# Altium schematic sheet 4. PT100.SchDoc: 4. PT100
size A4; CompanyName: Keri Studio; DrawnBy: Ashish Talaviya; Organization: KERI STUDIO; Address1: ICG COMPOUND; Address2: NR. BHAVANI CIRCLE; Address3: A.K. ROAD; Address4: SURAT-395008; DocumentNumber: 4; Revision: 1.0; SheetNumber: 4; SheetTotal: 4
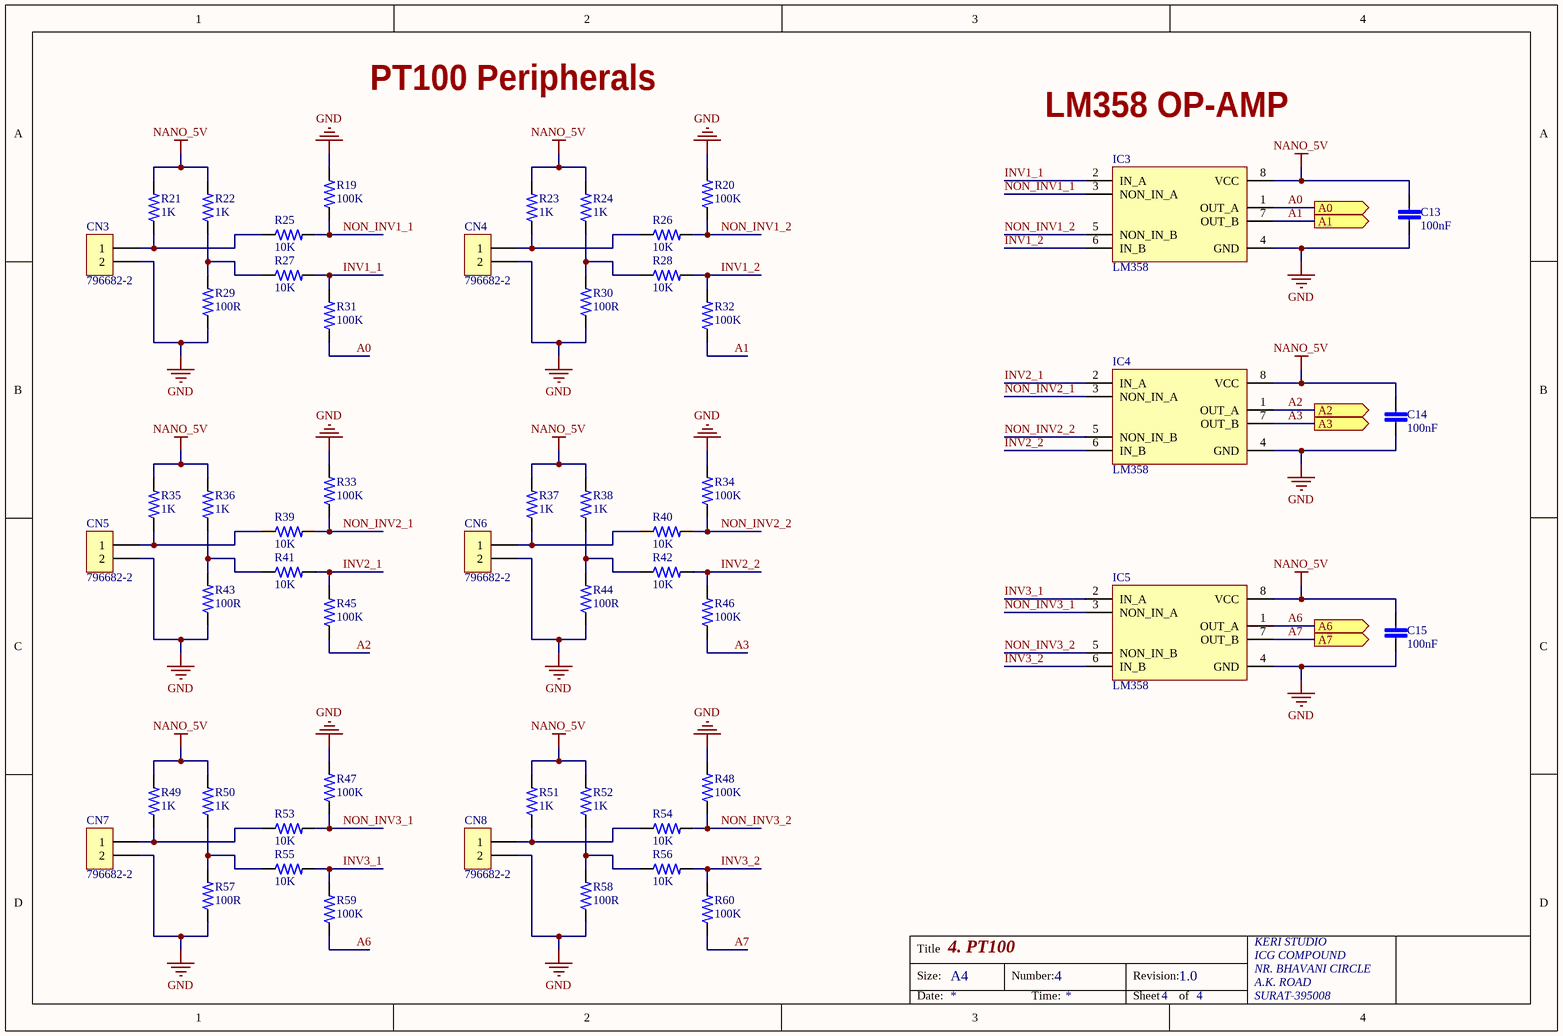
[diagram p0: 4. PT100.SchDoc]

## Parts
C13  100nF  [C0805]
C14  100nF  [C0805]
C15  100nF  [C0805]
CN3  796682-2  [Terminal_5.08mm_1X02]
CN4  796682-2  [Terminal_5.08mm_1X02]
CN5  796682-2  [Terminal_5.08mm_1X02]
CN6  796682-2  [Terminal_5.08mm_1X02]
CN7  796682-2  [Terminal_5.08mm_1X02]
CN8  796682-2  [Terminal_5.08mm_1X02]
IC3  LM358  [DIP-08]
IC4  LM358  [DIP-08]
IC5  LM358  [DIP-08]
R19  100K  [R0805]
R20  100K  [R0805]
R21  1K  [R0805]
R22  1K  [R0805]
R23  1K  [R0805]
R24  1K  [R0805]
R25  10K  [R0805]
R26  10K  [R0805]
R27  10K  [R0805]
R28  10K  [R0805]
R29  100R  [R0805]
R30  100R  [R0805]
R31  100K  [R0805]
R32  100K  [R0805]
R33  100K  [R0805]
R34  100K  [R0805]
R35  1K  [R0805]
R36  1K  [R0805]
R37  1K  [R0805]
R38  1K  [R0805]
R39  10K  [R0805]
R40  10K  [R0805]
R41  10K  [R0805]
R42  10K  [R0805]
R43  100R  [R0805]
R44  100R  [R0805]
R45  100K  [R0805]
R46  100K  [R0805]
R47  100K  [R0805]
R48  100K  [R0805]
R49  1K  [R0805]
R50  1K  [R0805]
R51  1K  [R0805]
R52  1K  [R0805]
R53  10K  [R0805]
R54  10K  [R0805]
R55  10K  [R0805]
R56  10K  [R0805]
R57  100R  [R0805]
R58  100R  [R0805]
R59  100K  [R0805]
R60  100K  [R0805]

## Ports
A0 (out), A1 (out), A2 (out), A3 (out), A6 (out), A7 (out)

## Nets
GND: C13.2 C14.2 C15.2 CN3.2 CN4.2 CN5.2 CN6.2 CN7.2 CN8.2 IC3.4(GND) IC4.4(GND) IC5.4(GND) R19.2 R20.2 R29.1 R30.1 R33.2 R34.2 R43.1 R44.1 R47.2 R48.2 R57.1 R58.1
NANO_5V: C13.1 C14.1 C15.1 IC3.8(VCC) IC4.8(VCC) IC5.8(VCC) R21.2 R22.2 R23.2 R24.2 R35.2 R36.2 R37.2 R38.2 R49.2 R50.2 R51.2 R52.2
A0: IC3.1(OUT_A) R31.1 ; port A0
A1: IC3.7(OUT_B) R32.1 ; port A1
A2: IC4.1(OUT_A) R45.1 ; port A2
A3: IC4.7(OUT_B) R46.1 ; port A3
A6: IC5.1(OUT_A) R59.1 ; port A6
A7: IC5.7(OUT_B) R60.1 ; port A7
INV1_1: IC3.2(IN_A) R27.2 R31.2
INV1_2: IC3.6(IN_B) R28.2 R32.2
INV2_1: IC4.2(IN_A) R41.2 R45.2
INV2_2: IC4.6(IN_B) R42.2 R46.2
INV3_1: IC5.2(IN_A) R55.2 R59.2
INV3_2: IC5.6(IN_B) R56.2 R60.2
NON_INV1_1: IC3.3(NON_IN_A) R19.1 R25.2
NON_INV1_2: IC3.5(NON_IN_B) R20.1 R26.2
NON_INV2_1: IC4.3(NON_IN_A) R33.1 R39.2
NON_INV2_2: IC4.5(NON_IN_B) R34.1 R40.2
NON_INV3_1: IC5.3(NON_IN_A) R47.1 R53.2
NON_INV3_2: IC5.5(NON_IN_B) R48.1 R54.2
NetCN3_1: CN3.1 R21.1 R25.1
NetCN4_1: CN4.1 R23.1 R26.1
NetCN5_1: CN5.1 R35.1 R39.1
NetCN6_1: CN6.1 R37.1 R40.1
NetCN7_1: CN7.1 R49.1 R53.1
NetCN8_1: CN8.1 R51.1 R54.1
NetR22_1: R22.1 R27.1 R29.2
NetR24_1: R24.1 R28.1 R30.2
NetR36_1: R36.1 R41.1 R43.2
NetR38_1: R38.1 R42.1 R44.2
NetR50_1: R50.1 R55.1 R57.2
NetR52_1: R52.1 R56.1 R58.2

## Notes on the sheet
- PT100 Peripherals
- LM358 OP-AMP
- Title
- Size:
- A4
- Number:
- Revision:
- Date:
- Time:
- Sheet
- of

## Library data of the parts
C13-C15 = C_0805_0.1uF: Multilayer Ceramic Capacitors MLCC - SMD/SMT 0805 0.1uF 50volts X7R 20%; Manufacturer: Murata; Manufacturer Part Number: GCJ21BR71H104MA01L; Supplier 1: Mouser; Supplier Part Number 1: 81-GCJ21BR71H104MA1L; Stock 1: 0
CN3-CN8 = Terminal_5.08mm_1X02: Fixed Terminal Blocks TERMI-BLOK PCB; Manufacturer: TE Connectivity; Plating: Brass,Nickel; Number of Positions: 2; Number of Levels: 1; Current: 17.5A; Voltage: 300V; Connector Type: Receptacle; Closed End: No (Without); Interlock: Yes (With); Wire Gauge (Max): 30AWG; Pitch: 5mm; Thread Size: M3; Tail Length: 3.5mm; Supplier 1: Mouser; Manufacturer Part Number: 796682-2; Stock 1: 1299; Pricing 1: 1=1.06, 10=0.737, 50=0.623, 100=0.62, 1000=0.441, 10000=0.367 (USD); Mount: Through Hole; Contact Plating: Tin; Contact Material: Brass; Colour: Black; Housing Material: Polyamide; Housing Colour: Black; Min Operating Temperature: -40°C; Max Operating Temperature: 105°C; Number of Rows: 1; Packaging: Bulk; Package Quantity: 300; Termination: Solder; Number of Positions Per Level: 2; Orientation: Straight; Max Current Rating: 17.5A; Current Rating: 17.5A; Voltage Rating: 300V; Number of Contacts: 2; Max Voltage Rating (AC): 300V; Number of Circuits: 2; Max Supply Voltage (AC): 300V; Screw Flange: No (Without); Screwless Terminal Block: No (Without); Side Stackable: No (Without); Length: 10.5mm; Height: 15.5mm; Wire Gauge (Min): 30AWG; Depth: 9mm; Width: 9mm; Radiation Hardening: No; Flammability Rating: UL94 V-0; Lead Free: Lead Free; ELV: Compliant; ComponentLink1URL: http://components.arrow.com/part/dataview/0323_03914338; ComponentLink1Description: http://components.arrow.com/part/dataview/0323_03914338; ComponentLink2URL: http://www.onlinecomponents.com/productFiles/mf-AMP/eng_cs_1308389_eurostyle_terminal_blocks_0607.pdf; ComponentLink2Description: http://www.onlinecomponents.com/productFiles/mf-AMP/eng_cs_1308389_eurostyle_terminal_blocks_0607.pdf; ComponentLink3URL: http://www.jameco.com/Jameco/Products/ProdDS/759341.pdf; ComponentLink3Description: http://www.jameco.com/Jameco/Products/ProdDS/759341.pdf; ComponentLink4URL: http://www.te.com/commerce/DocumentDelivery/DDEController?Action=showdoc&DocId=Catalog+Section%7F1308389_EUROSTYLE_TERMINAL_BLOCKS%7F0607%7Fpdf%7FEnglish%7FENG_CS_1308389_EUROSTYLE_TERMINAL_BLOCKS_0607.pdf; ComponentLink4Description: http://www.te.com/commerce/DocumentDelivery/DDEController?Action=showdoc&DocId=Catalog+Section%7F1308389_EUROSTYLE_TERMINAL_BLOCKS%7F0607%7Fpdf%7FEnglish%7FENG_CS_1308389_EUROSTYLE_TERMINAL_BLOCKS_0607.pdf; ComponentLink5URL: http://components.arrow.com/part/dataview/3050970S8348740N5665; ComponentLink5Description: http://components.arrow.com/part/dataview/3050970S8348740N5665; ComponentLink6URL: http://www.te.com/catalog/pn/en/796682-2?RQPN=796682-2; ComponentLink6Description: http://www.te.com/catalog/pn/en/796682-2?RQPN=796682-2; ComponentLink7URL: http://www.te.com/commerce/DocumentDelivery/DDEController?Action=srchrtrv&DocNm=796682&DocType=Customer+Drawing&DocLang=English; ComponentLink7Description: http://www.te.com/commerce/DocumentDelivery/DDEController?Action=srchrtrv&DocNm=796682&DocType=Customer+Drawing&DocLang=English; Supplier Part Number 1: 571-796682-2
IC3-IC5 = LM358: IC OPAMP GP 700KHZ 8SOIC; Manufacturer: Texas Instruments; Manufacturer Part Number: LM358ADR; Min Supply Voltage: 3V; Max Supply Voltage: 32V; Min Dual Supply Voltage: 1.5V; Max Dual Supply Voltage: 16V; Voltage Gain: 100dB; Slew Rate: 0.3V/µs; Common Mode Rejection Ratio: 65dB; Number of Channels: 2; Output Current: 30mA; Nominal Supply Current: 1.2mA; Input Bias Current: 100nA; Input Offset Voltage (Vos): 3mV; Operating Supply Current: 1mA; Dual Supply Voltage: 9V; Supplier 1: Mouser; Stock 1: 276952; Pricing 1: 1=0.36, 10=0.271, 50=0.271, 100=0.147, 1000=0.11, 10000=0.089 (USD); Mount: Surface Mount; Case/Package: SOIC; Number of Pins: 8; Min Operating Temperature: 0°C; Max Operating Temperature: 70°C; Packaging: Tape and Reel; Package Quantity: 2500; Operating Supply Voltage: 16V; Number of Circuits: 2; Gain Bandwidth Product: 700kHz; Output Current per Channel: 30mA; Number of Elements: 2; Unity Gain Bandwidth Product: 700kHz; Bandwidth: 700kHz; Number of Amplifiers: 2; Length: 4.9mm; Height: 1.58mm; Width: 3.91mm; Radiation Hardening: No; Lead Free: Lead Free; REACH SVHC: No SVHC; ComponentLink1URL: https://datasheet.ciiva.com/1796/lm358-1796562.pdf; ComponentLink1Description: https://datasheet.ciiva.com/1796/lm358-1796562.pdf; ComponentLink2URL: https://datasheet.ciiva.com/1796/lm358-1796563.pdf; ComponentLink2Description: https://datasheet.ciiva.com/1796/lm358-1796563.pdf; ComponentLink3URL: https://datasheet.ciiva.com/1796/lm358-1796564.pdf; ComponentLink3Description: https://datasheet.ciiva.com/1796/lm358-1796564.pdf; ComponentLink4URL: https://datasheet.ciiva.com/2973/lm358a-2973371.pdf; ComponentLink4Description: https://datasheet.ciiva.com/2973/lm358a-2973371.pdf; Supplier Part Number 1: 595-LM358ADR
R19 R20 R31-R34 R45-R48 R59 R60 = R_0805_100K: Thick Film Resistors - SMD 100K 0805 5%; Manufacturer: Bourns; Manufacturer Part Number: CR0805-JW-104ELF; Resistance: 100kR; Temperature Coefficient: 200ppm/°C; Voltage Rating: 150V; Power Rating: 125mW; Supplier 1: Mouser; Supplier Part Number 1: 652-CR0805JW-104ELF; Stock 1: 38668; Pricing 1: 1=0.1, 10=0.068, 50=0.068, 100=0.028, 1000=0.011, 10000=0.006 (USD); Mount: Surface Mount; Case/Package: 0805; Contact Plating: Tin; Case Code (Imperial): 0805; Case Code (Metric): 2012; Min Operating Temperature: -55°C; Max Operating Temperature: 155°C; Tolerance: 5%; Composition: Thick Film; Package Quantity: 5000; Packaging: Tape and Reel; Termination: SMD/SMT; Military Standard: Not; Voltage Rating (DC): 150V; Length: 2mm; Height: 0.5mm; Width: 1.25mm; Depth: 1.25mm; Thickness: 508um; Radiation Hardening: No; REACH SVHC: No SVHC; ComponentLink1URL: https://datasheet.ciiva.com/11809/0900766b80fcdb72-11809030.pdf; ComponentLink1Description: https://datasheet.ciiva.com/11809/0900766b80fcdb72-11809030.pdf; ComponentLink2URL: https://datasheet.ciiva.com/9120/chpreztr-9120778.pdf; ComponentLink2Description: https://datasheet.ciiva.com/9120/chpreztr-9120778.pdf
R21-R24 R35-R38 R49-R52 = R_0805_1K: Thick Film Resistors - SMD 1K 5%; Manufacturer: Bourns; Manufacturer Part Number: CR0805-JW-102ELF; Resistance: 1kR; Temperature Coefficient: 200ppm/°C; Power Rating: 125mW; Voltage Rating: 150V; Supplier 1: Mouser; Stock 1: 29079; Pricing 1: 1=0.1, 10=0.03, 50=0.03, 100=0.017, 1000=0.008, 10000=0.006 (USD); Mount: Surface Mount; Case/Package: 0805; Number of Pins: 2; Contact Plating: Tin; Case Code (Metric): 2012; Case Code (Imperial): 0805; Min Operating Temperature: -55°C; Max Operating Temperature: 155°C; Tolerance: 5%; Composition: Thick Film; Package Quantity: 1; Packaging: Tape and Reel; Number of Terminations: 2; Termination: SMD/SMT; Military Standard: Not; Max Power Dissipation: 125mW; Voltage Rating (DC): 150V; Length: 2mm; Height: 0.5mm; Width: 1.25mm; Depth: 1.25mm; Thickness: 508um; Radiation Hardening: No; REACH SVHC: No SVHC; Lead Free: Lead Free; ComponentLink1URL: https://datasheet.ciiva.com/11821/0900766b80fcdb72-11821134.pdf; ComponentLink1Description: https://datasheet.ciiva.com/11821/0900766b80fcdb72-11821134.pdf; ComponentLink2URL: https://datasheet.ciiva.com/15225/getdatasheetpartid-78155-15225381.pdf; ComponentLink2Description: https://datasheet.ciiva.com/15225/getdatasheetpartid-78155-15225381.pdf; ComponentLink3URL: https://datasheet.ciiva.com/22693/1902866-22693253.pdf; ComponentLink3Description: https://datasheet.ciiva.com/22693/1902866-22693253.pdf; ComponentLink4URL: https://datasheet.ciiva.com/7986/1856384-7986184.pdf; ComponentLink4Description: https://datasheet.ciiva.com/7986/1856384-7986184.pdf; ComponentLink5URL: https://datasheet.ciiva.com/16934/chpreztr-16934442.pdf; ComponentLink5Description: https://datasheet.ciiva.com/16934/chpreztr-16934442.pdf; ComponentLink6URL: https://datasheet.ciiva.com/7985/1856384-7985867.pdf; ComponentLink6Description: https://datasheet.ciiva.com/7985/1856384-7985867.pdf; ComponentLink7URL: https://datasheet.ciiva.com/30242/159chpreztr-30242765.pdf; ComponentLink7Description: https://datasheet.ciiva.com/30242/159chpreztr-30242765.pdf; ComponentLink8URL: https://datasheet.ciiva.com/6547/chpreztr-6547359.pdf; ComponentLink8Description: https://datasheet.ciiva.com/6547/chpreztr-6547359.pdf; Supplier Part Number 1: 652-CR0805JW-102ELF
R25-R28 R39-R42 R53-R56 = R_0805_10K: Thick Film Resistors - SMD 10K 0805 5%; Manufacturer: Bourns; Manufacturer Part Number: CR0805-JW-103ELF; Resistance: 10kR; Temperature Coefficient: 200ppm/°C; Power Rating: 125mW; Voltage Rating: 150V; Voltage Rating (DC): 100V; Supplier 1: Mouser; Supplier Part Number 1: 652-CR0805-JW-103ELF; Stock 1: 36802; Pricing 1: 1=0.1, 10=0.03, 50=0.03, 100=0.017, 1000=0.008, 10000=0.006 (USD); Mount: Surface Mount; Case/Package: 0805; Number of Pins: 2; Contact Plating: Tin; Case Code (Metric): 2012; Case Code (Imperial): 0805; Min Operating Temperature: -55°C; Max Operating Temperature: 155°C; Tolerance: 5%; Composition: Thick Film; Package Quantity: 1; Packaging: Tape and Reel; Number of Terminations: 2; Termination: SMD/SMT; Military Standard: Not; Max Power Dissipation: 125mW; Length: 2mm; Height: 0.5mm; Width: 1.25mm; Depth: 1.25mm; Thickness: 508um; Radiation Hardening: No; REACH SVHC: No SVHC; ComponentLink1URL: https://datasheet.ciiva.com/11821/0900766b80fcdb72-11821135.pdf; ComponentLink1Description: https://datasheet.ciiva.com/11821/0900766b80fcdb72-11821135.pdf; ComponentLink2URL: https://datasheet.ciiva.com/9122/chpreztr-9122374.pdf; ComponentLink2Description: https://datasheet.ciiva.com/9122/chpreztr-9122374.pdf; ComponentLink3URL: https://datasheet.ciiva.com/22693/1902866-22693254.pdf; ComponentLink3Description: https://datasheet.ciiva.com/22693/1902866-22693254.pdf; ComponentLink4URL: https://datasheet.ciiva.com/30065/159chpreztr-30065976.pdf; ComponentLink4Description: https://datasheet.ciiva.com/30065/159chpreztr-30065976.pdf; ComponentLink5URL: https://datasheet.ciiva.com/16783/70154685-16783482.pdf; ComponentLink5Description: https://datasheet.ciiva.com/16783/70154685-16783482.pdf; ComponentLink6URL: https://datasheet.ciiva.com/5548/chpreztr-5548491.pdf; ComponentLink6Description: https://datasheet.ciiva.com/5548/chpreztr-5548491.pdf; ComponentLink7URL: https://datasheet.ciiva.com/7986/691949-7986187.pdf; ComponentLink7Description: https://datasheet.ciiva.com/7986/691949-7986187.pdf; ComponentLink8URL: https://datasheet.ciiva.com/6559/chpreztr-6559900.pdf; ComponentLink8Description: https://datasheet.ciiva.com/6559/chpreztr-6559900.pdf; ComponentLink9URL: https://datasheet.ciiva.com/6559/chpreztr-6559901.pdf; ComponentLink9Description: https://datasheet.ciiva.com/6559/chpreztr-6559901.pdf; ComponentLink10URL: https://datasheet.ciiva.com/7985/1856384-7985869.pdf; ComponentLink10Description: https://datasheet.ciiva.com/7985/1856384-7985869.pdf; ComponentLink11URL: https://datasheet.ciiva.com/48692/001055517-da-01-en-smd-wid-cr0805-jw-103elf-10k-ohm-1-8w-48692118.pdf; ComponentLink11Description: https://datasheet.ciiva.com/48692/001055517-da-01-en-smd-wid-cr0805-jw-103elf-10k-ohm-1-8w-48692118.pdf
R29 R30 R43 R44 R57 R58 = R_0805_100R: Thick Film Resistors - SMD 10ohm 5%; Manufacturer: Bourns; Manufacturer Part Number: CR0805-JW-100ELF; Resistance: 10R; Temperature Coefficient: 200ppm/°C; Power Rating: 125mW; Voltage Rating: 150V; Supplier 1: Mouser; Stock 1: 30420; Pricing 1: 1=0.1, 10=0.068, 50=0.068, 100=0.028, 1000=0.011, 10000=0.006 (USD); Mount: Surface Mount; Case/Package: 0805; Contact Plating: Tin; Case Code (Imperial): 0805; Case Code (Metric): 2012; Min Operating Temperature: -55°C; Max Operating Temperature: 155°C; Tolerance: 5%; Composition: Thick Film; Packaging: Tape and Reel; Package Quantity: 5000; Termination: SMD/SMT; Number of Terminations: 2; Military Standard: Not; Max Power Dissipation: 125mW; Voltage Rating (DC): 150V; Length: 2mm; Height: 0.5mm; Width: 1.25mm; Depth: 1.25mm; Thickness: 508um; Radiation Hardening: No; REACH SVHC: No SVHC; ComponentLink1URL: https://datasheet.ciiva.com/11808/0900766b80fcdb72-11808714.pdf; ComponentLink1Description: https://datasheet.ciiva.com/11808/0900766b80fcdb72-11808714.pdf; ComponentLink2URL: https://datasheet.ciiva.com/16934/chpreztr-16934424.pdf; ComponentLink2Description: https://datasheet.ciiva.com/16934/chpreztr-16934424.pdf; Supplier Part Number 1: 652-CR0805JW-100ELF